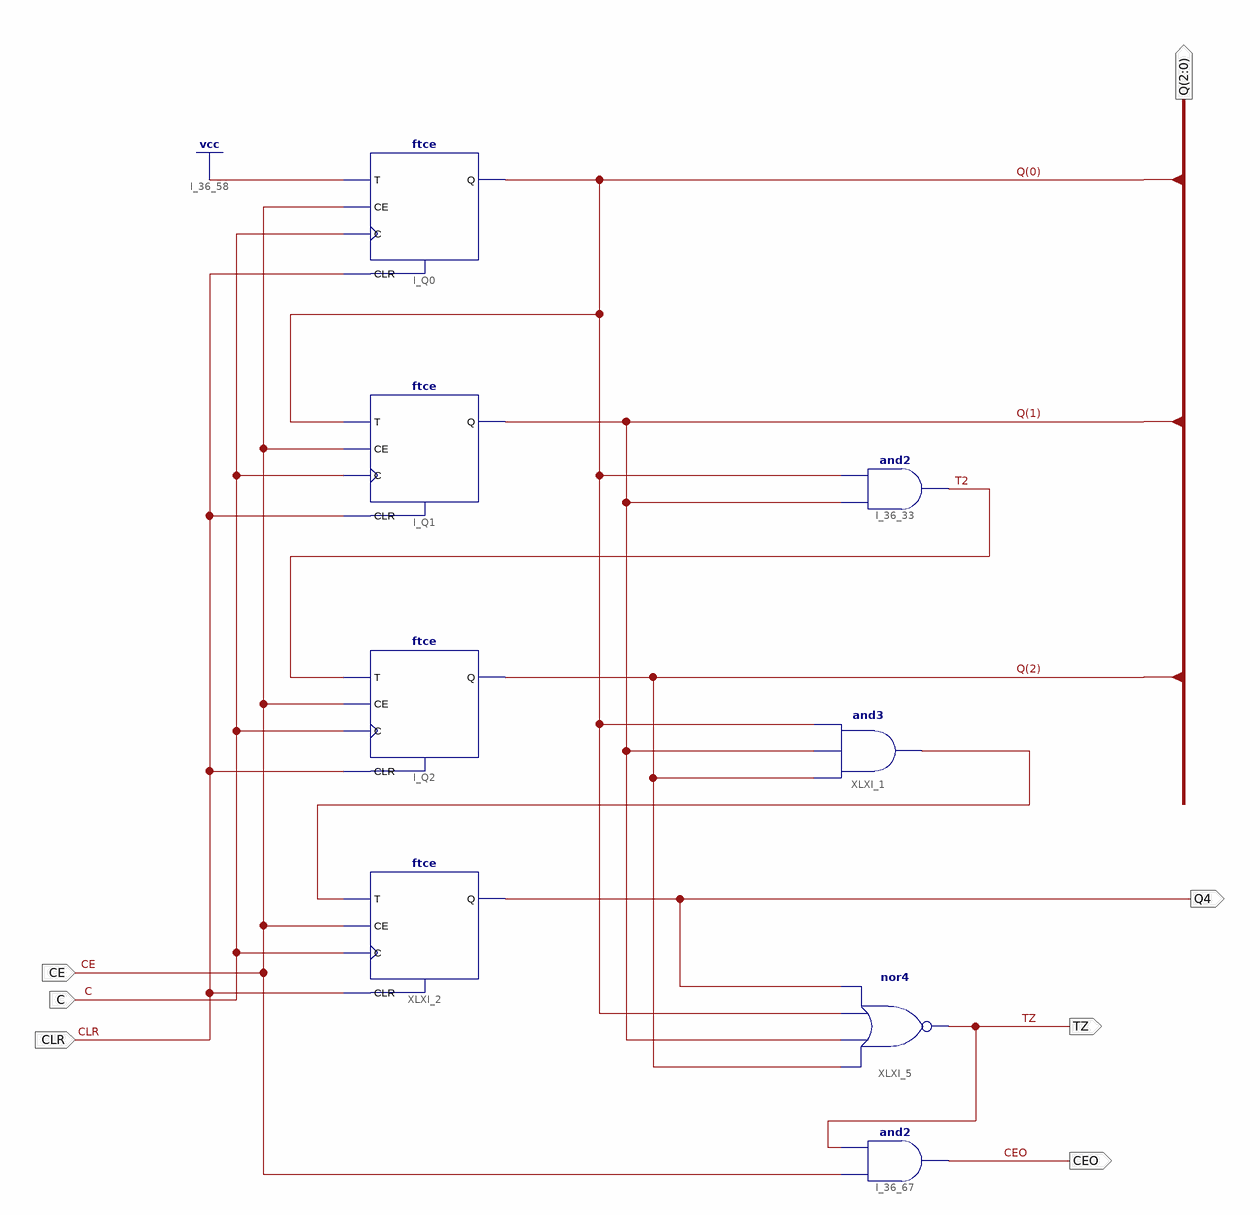
[diagram p0: schematic sheet 1]
// Xilinx ISE schematic cb3ce.sch (spartan3e) as structural Verilog: 8 symbols, 7 ports
module cb3ce (
  input  C,
  input  CLR,
  input  CE,
  output CEO,
  output TZ,
  output [2:0] Q,
  output Q4
);

  wire T2, XLXN_21;

  and I_36_33 (T2, Q[1], Q[0]);
  and I_36_67 (CEO, CE, TZ);
  ftce I_Q0 (.C(C), .CE(CE), .CLR(CLR), .T(1'b1), .Q(Q[0]));
  ftce I_Q1 (.C(C), .CE(CE), .CLR(CLR), .T(Q[0]), .Q(Q[1]));
  ftce I_Q2 (.C(C), .CE(CE), .CLR(CLR), .T(T2), .Q(Q[2]));
  ftce XLXI_2 (.C(C), .CE(CE), .CLR(CLR), .T(XLXN_21), .Q(Q4));
  and XLXI_1 (XLXN_21, Q[0], Q[1], Q[2]);
  nor XLXI_5 (TZ, Q4, Q[0], Q[1], Q[2]);
endmodule
